# EAGLE schematic Bottom_PCB (EAGLE 9.7.0)
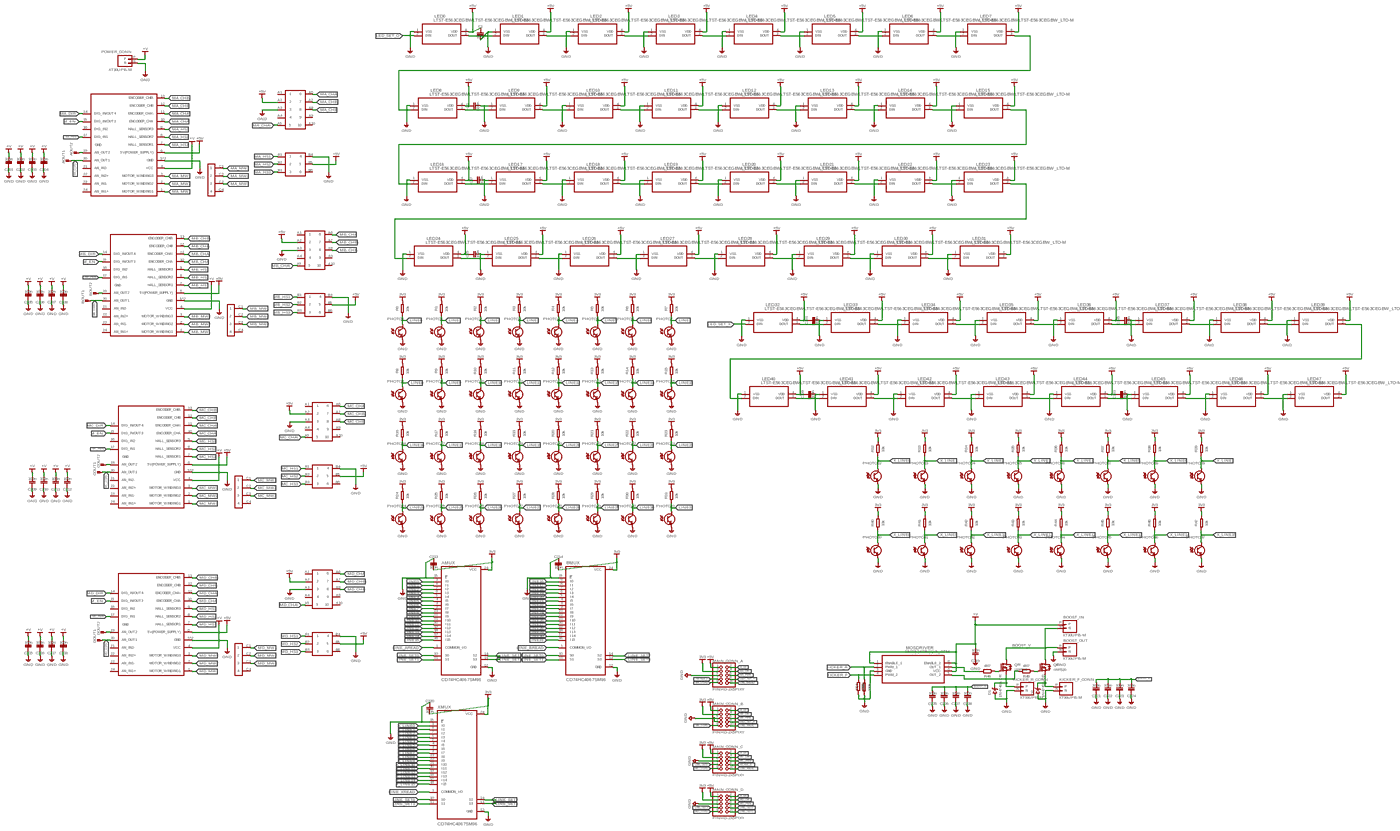
[diagram p0: schematic, sheet 1, overview]
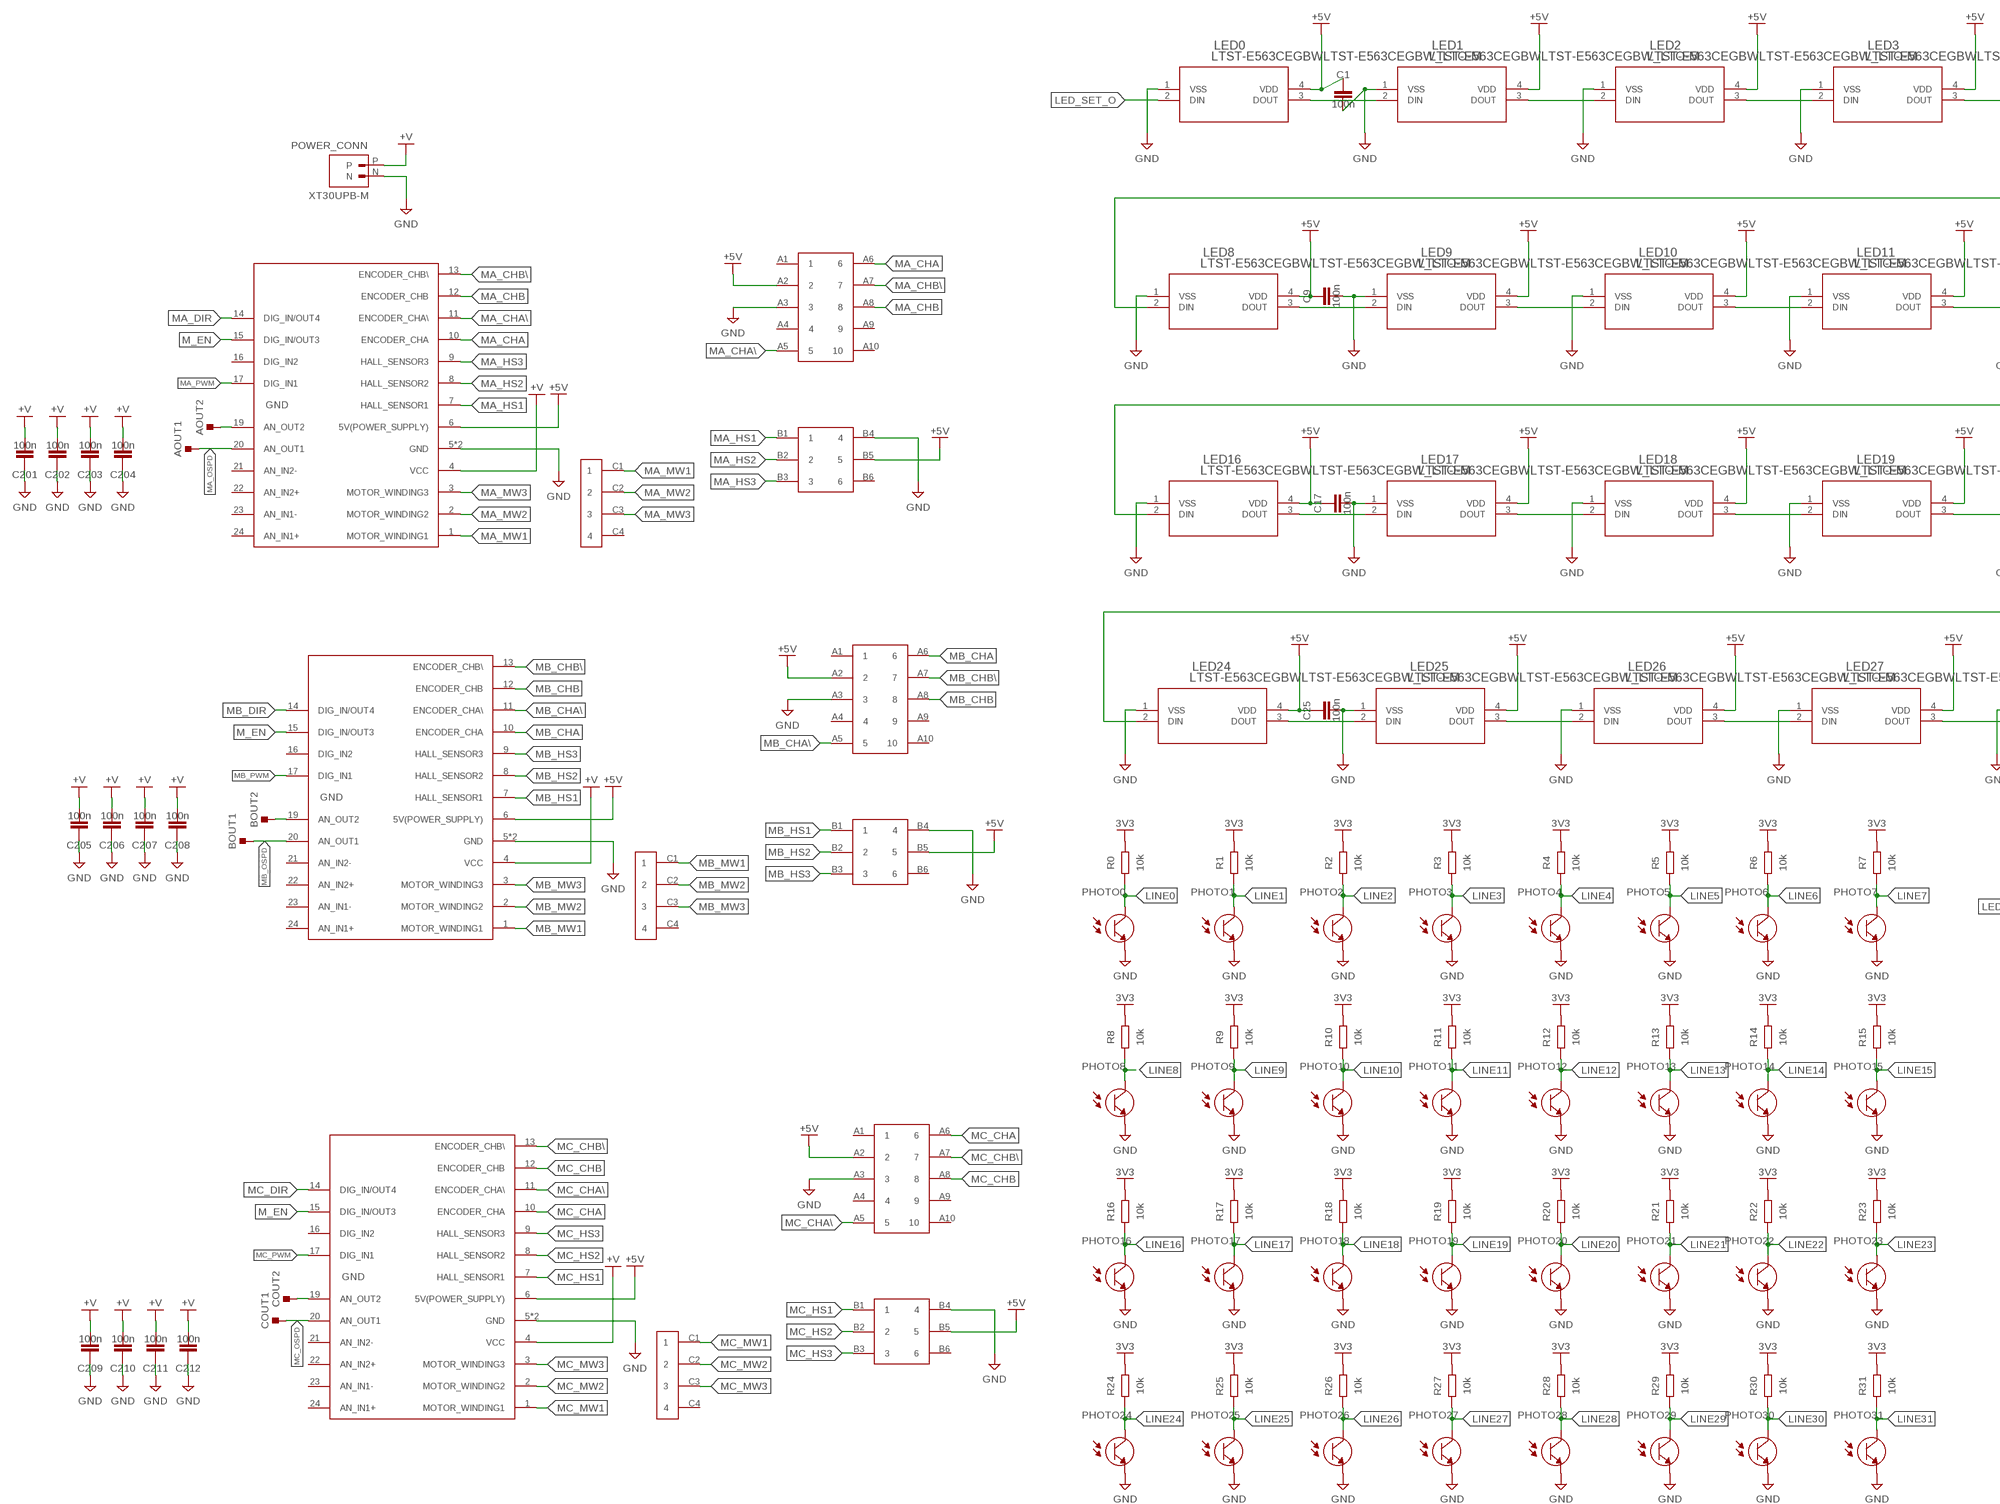
[diagram p1: schematic, sheet 1, part 1 of 4]
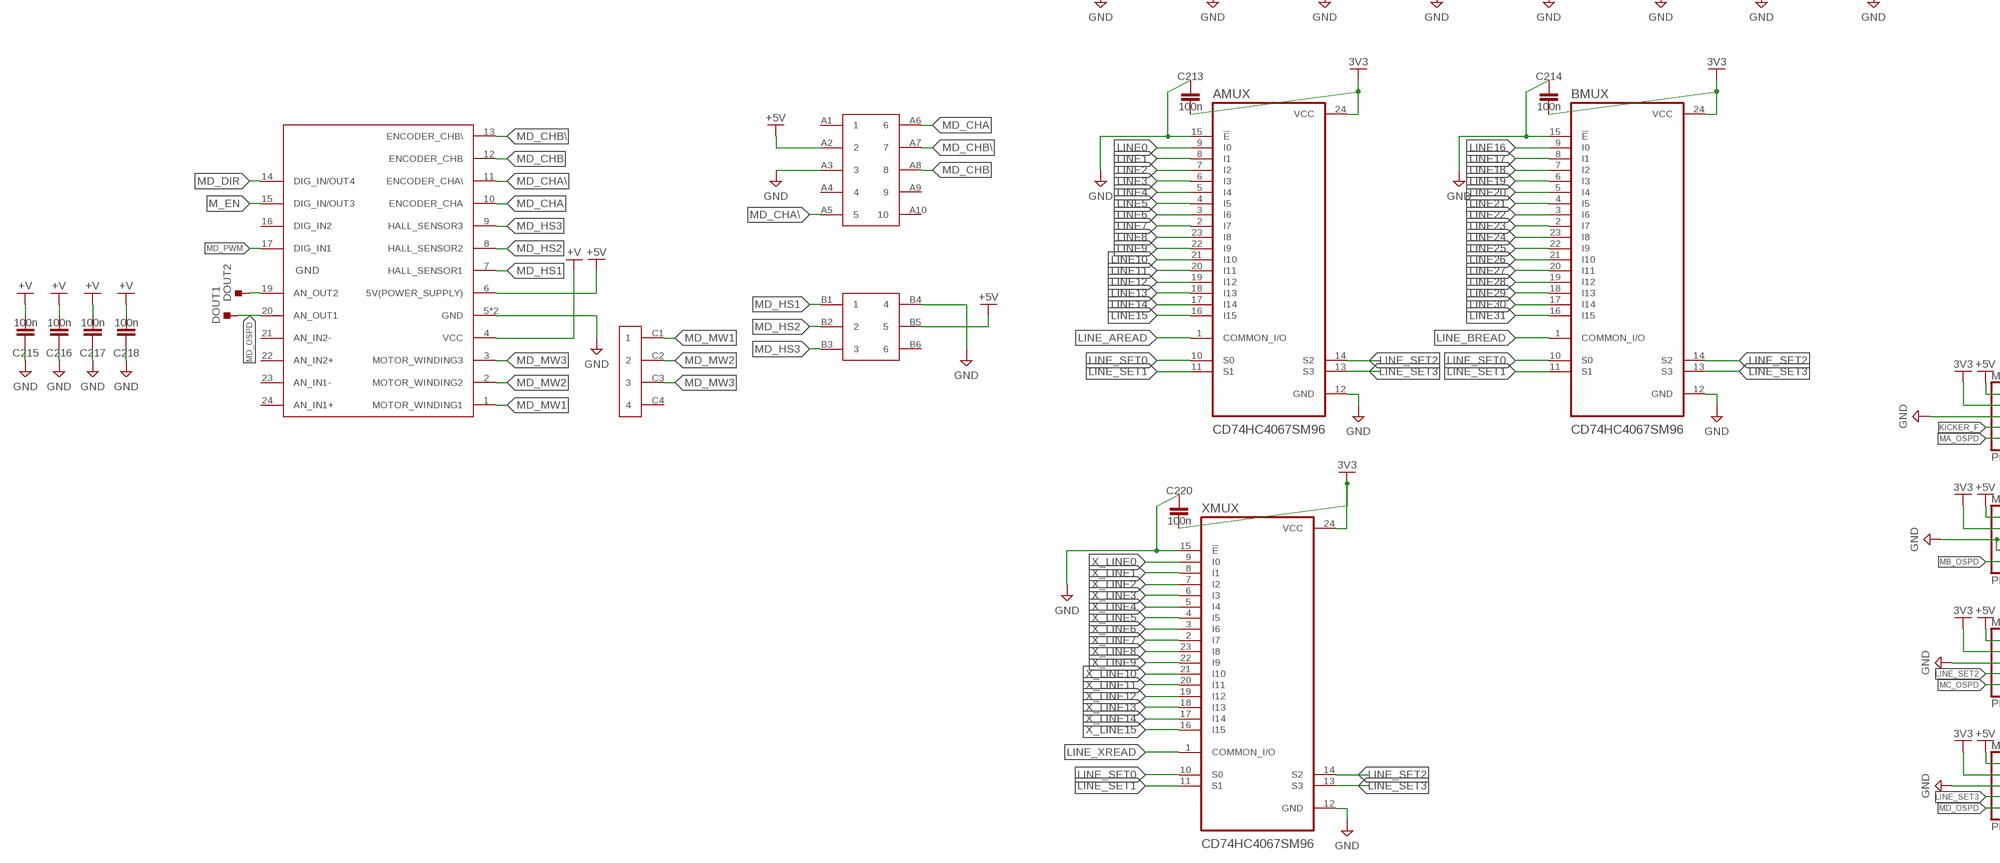
[diagram p2: schematic, sheet 1, part 2 of 4]
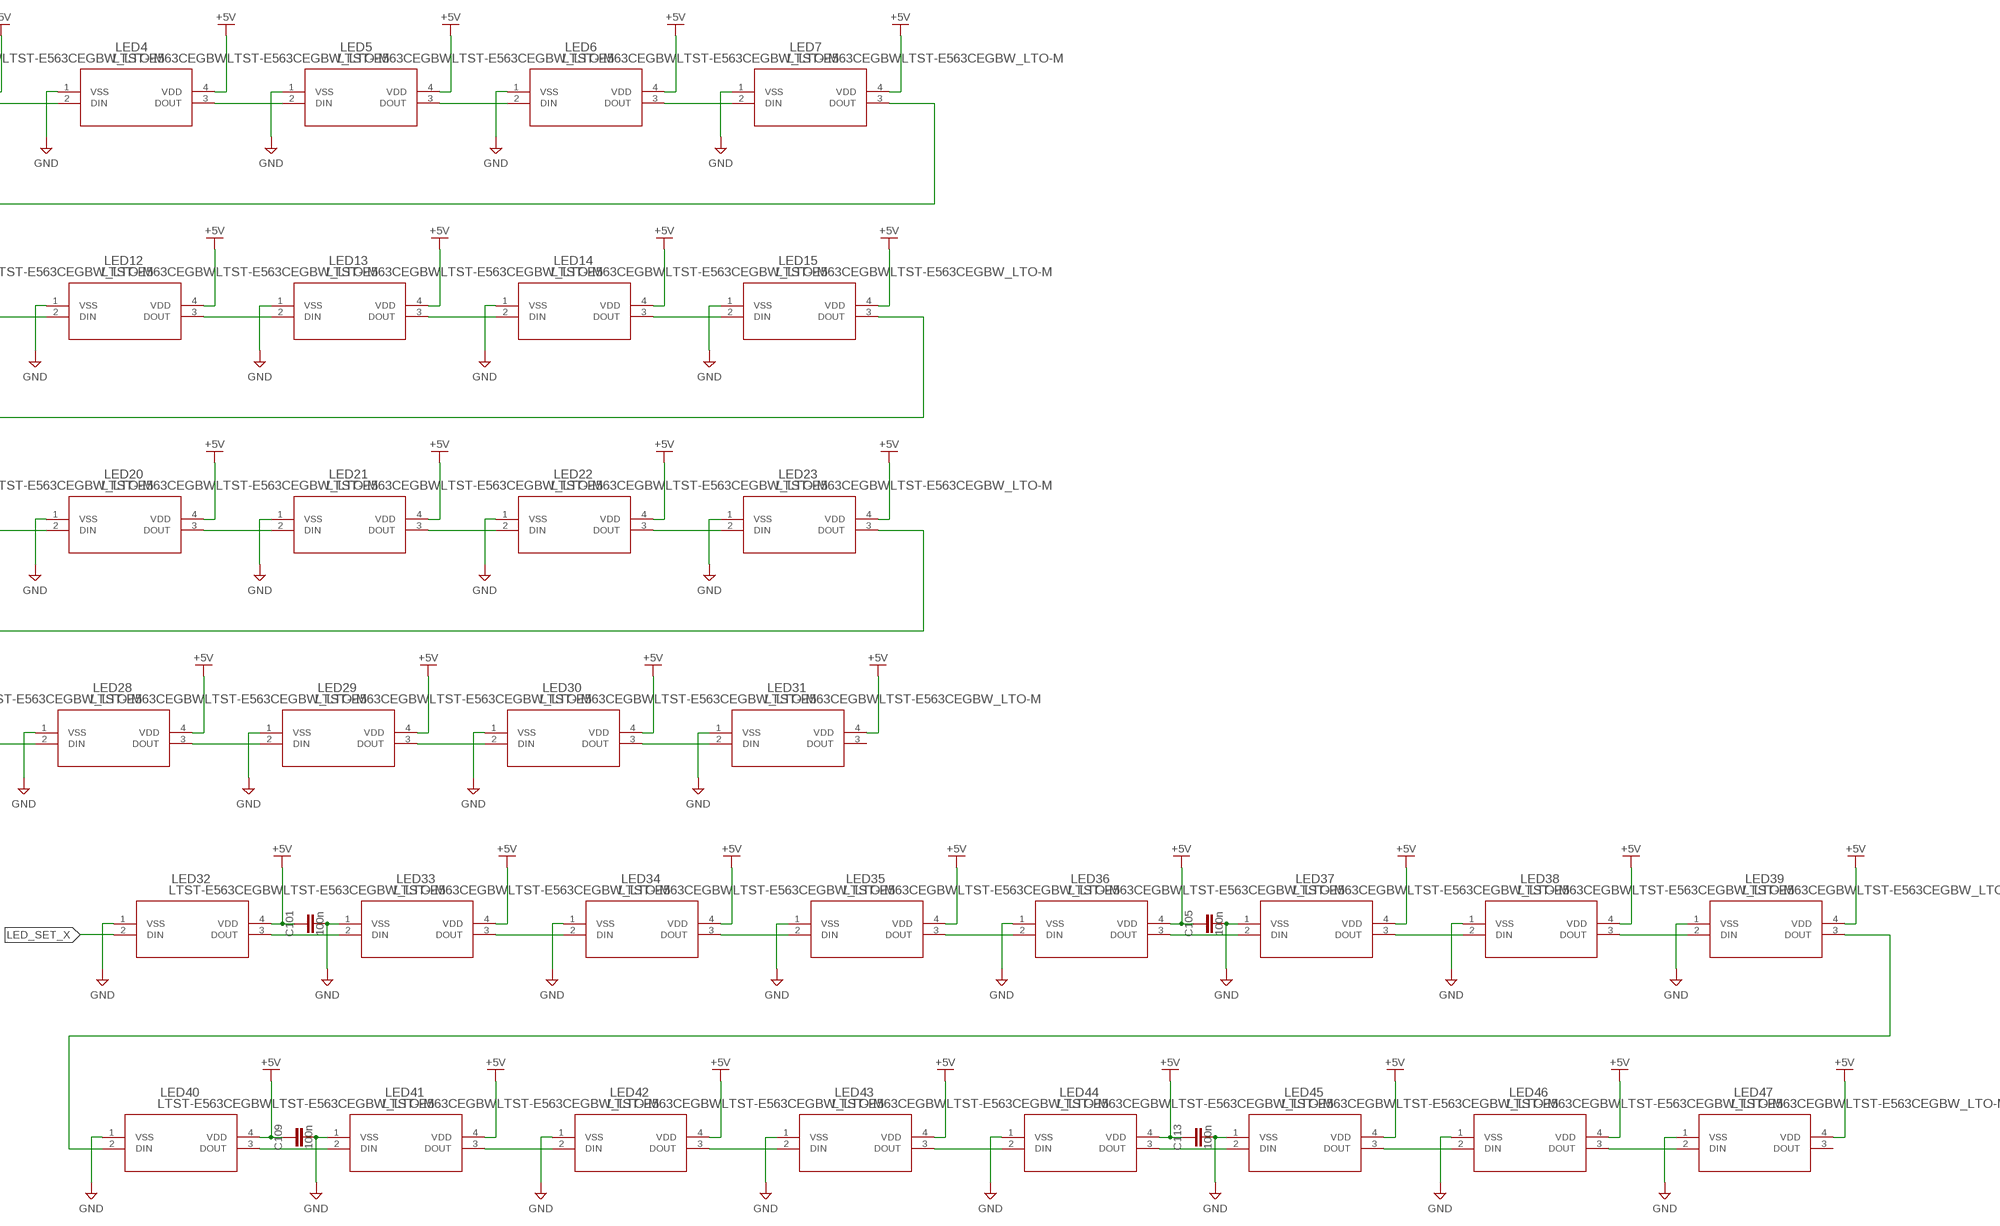
[diagram p3: schematic, sheet 1, part 3 of 4]
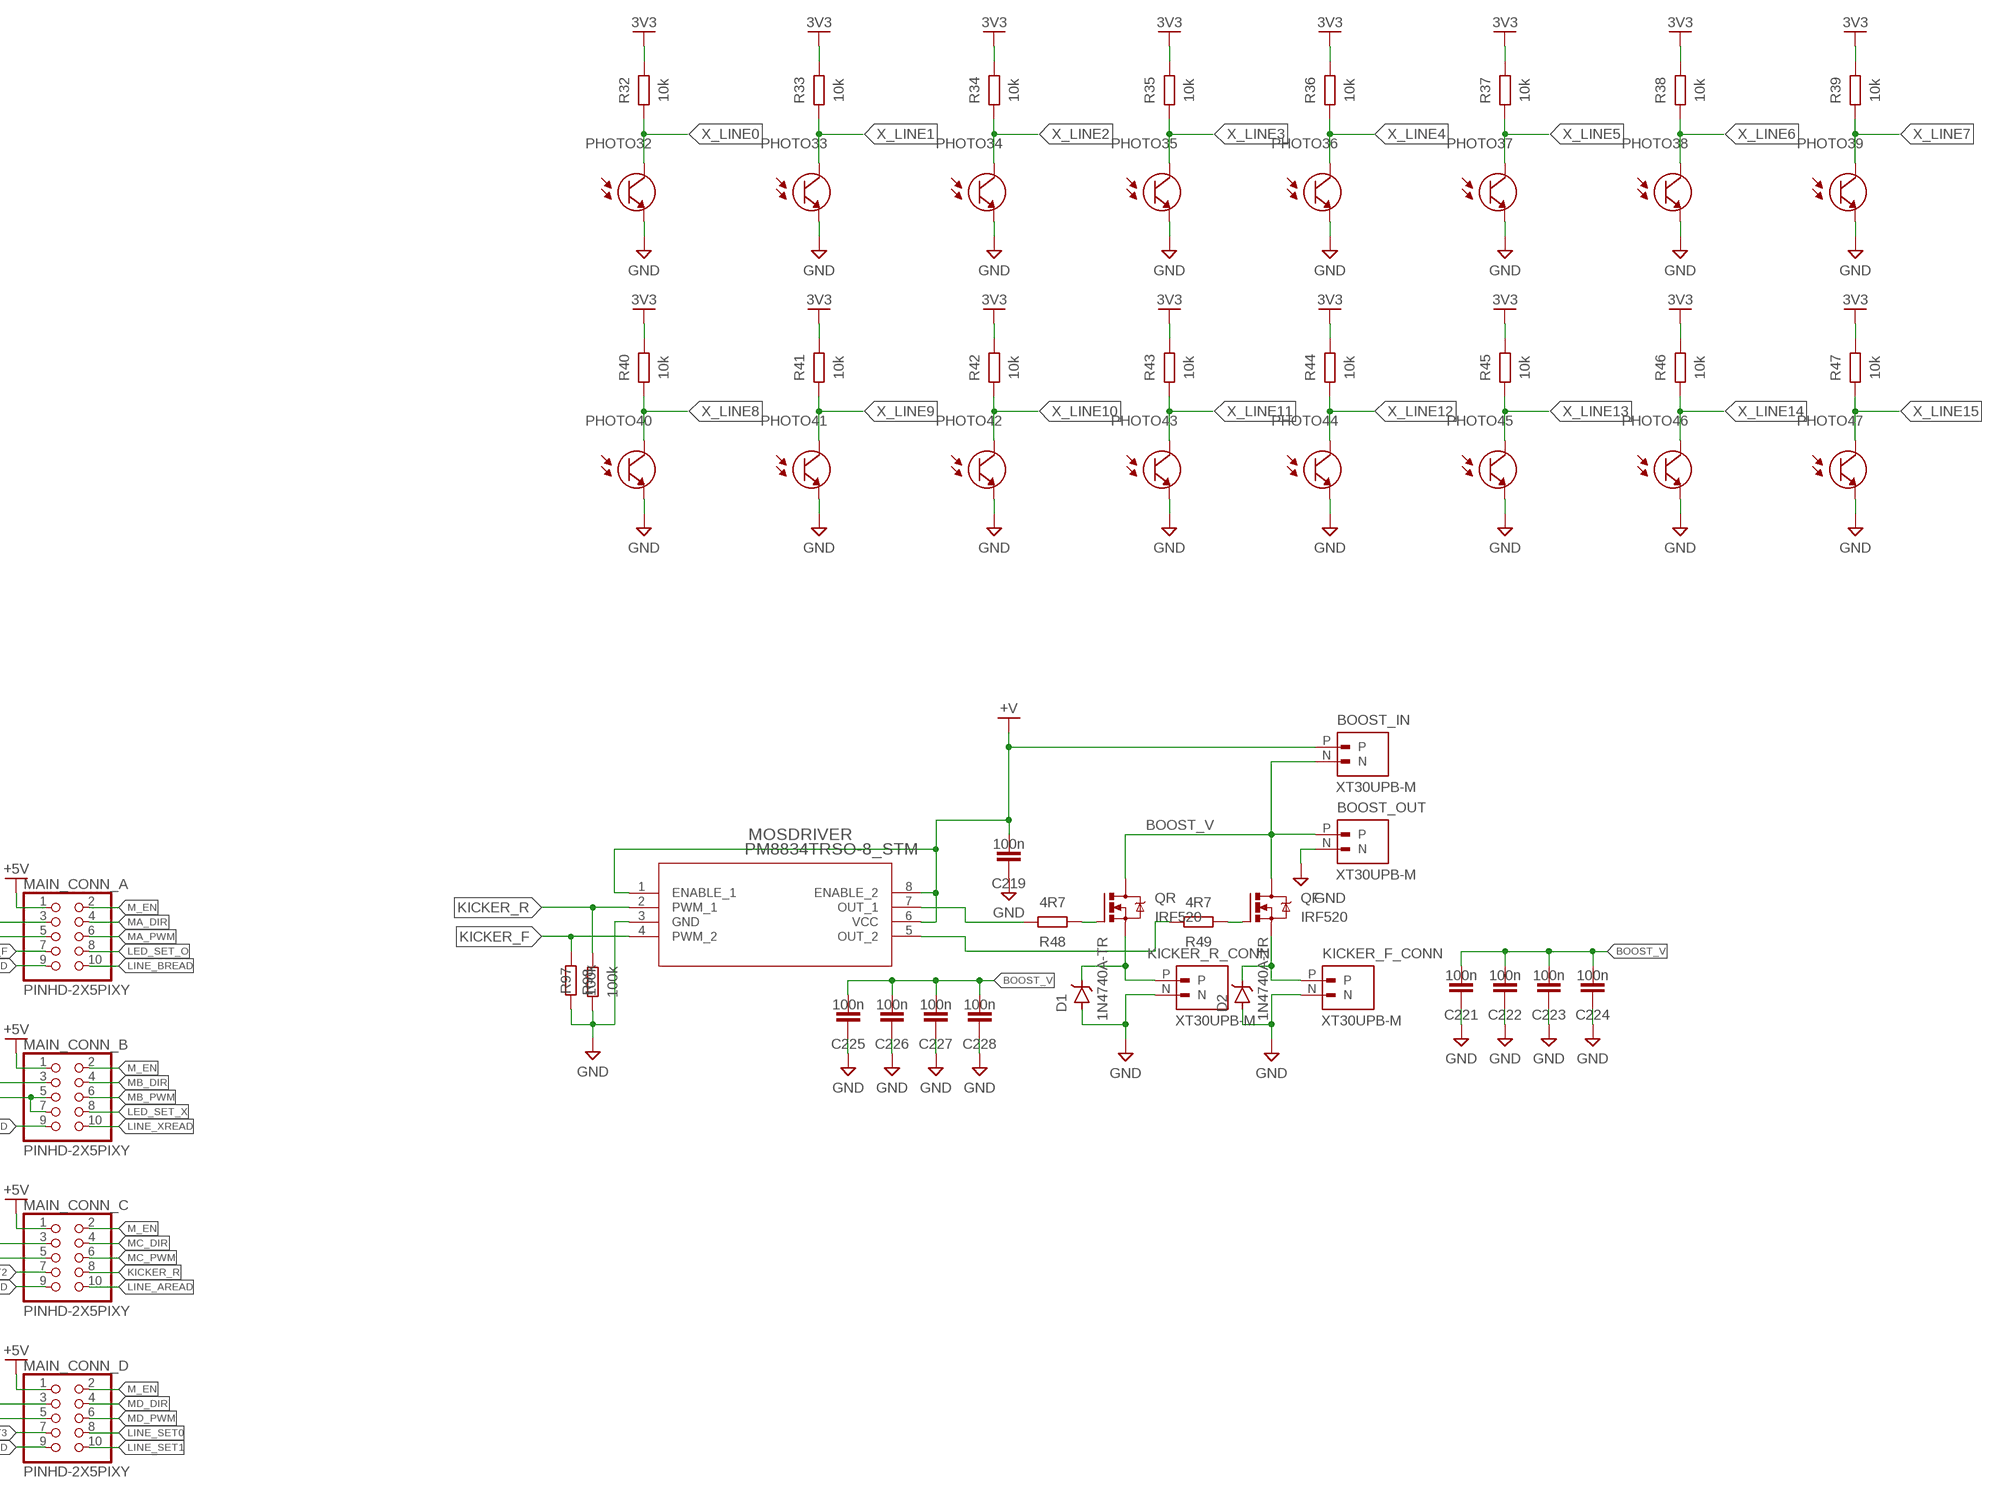
[diagram p4: schematic, sheet 1, part 4 of 4]

## Parts
AENC  PIN2.54-2X5  [PIN2.54-2X5]
AHAL  MX-44914-0601  [MX-44914-0601]
AMD  ESCON24/224/2  [ESCON24/2]
AMUX  CD74HC4067SM96  [SOP65P780X200-24N]
AMW  MX5566  [MX5566]
AOUT1  TESTPOINT_TPS-PAD-036  [TESTPOINT_PAD-036]
AOUT2  TESTPOINT_TPS-PAD-036  [TESTPOINT_PAD-036]
BENC  PIN2.54-2X5  [PIN2.54-2X5]
BHAL  MX-44914-0601  [MX-44914-0601]
BMD  ESCON24/224/2  [ESCON24/2]
BMUX  CD74HC4067SM96  [SOP65P780X200-24N]
BMW  MX5566  [MX5566]
BOOST_IN  XT30UPB-M  [AMASS_XT30UPB-M]
BOOST_OUT  XT30UPB-M  [AMASS_XT30UPB-M]
BOUT1  TESTPOINT_TPS-PAD-036  [TESTPOINT_PAD-036]
BOUT2  TESTPOINT_TPS-PAD-036  [TESTPOINT_PAD-036]
C1  100n  C_CHIP-0805(2012-METRIC)  [CAPC2012X110]
C9  100n  C_CHIP-0805(2012-METRIC)  [CAPC2012X110]
C17  100n  C_CHIP-0805(2012-METRIC)  [CAPC2012X110]
C25  100n  C_CHIP-0805(2012-METRIC)  [CAPC2012X110]
C101  100n  C_CHIP-0805(2012-METRIC)  [CAPC2012X110]
C105  100n  C_CHIP-0805(2012-METRIC)  [CAPC2012X110]
C109  100n  C_CHIP-0805(2012-METRIC)  [CAPC2012X110]
C113  100n  C_CHIP-0805(2012-METRIC)  [CAPC2012X110]
C201  100n  C_CHIP-0805(2012-METRIC)  [CAPC2012X110]
C202  100n  C_CHIP-0805(2012-METRIC)  [CAPC2012X110]
C203  100n  C_CHIP-0805(2012-METRIC)  [CAPC2012X110]
C204  100n  C_CHIP-0805(2012-METRIC)  [CAPC2012X110]
C205  100n  C_CHIP-0805(2012-METRIC)  [CAPC2012X110]
C206  100n  C_CHIP-0805(2012-METRIC)  [CAPC2012X110]
C207  100n  C_CHIP-0805(2012-METRIC)  [CAPC2012X110]
C208  100n  C_CHIP-0805(2012-METRIC)  [CAPC2012X110]
C209  100n  C_CHIP-0805(2012-METRIC)  [CAPC2012X110]
C210  100n  C_CHIP-0805(2012-METRIC)  [CAPC2012X110]
C211  100n  C_CHIP-0805(2012-METRIC)  [CAPC2012X110]
C212  100n  C_CHIP-0805(2012-METRIC)  [CAPC2012X110]
C213  100n  C_CHIP-0805(2012-METRIC)  [CAPC2012X110]
C214  100n  C_CHIP-0805(2012-METRIC)  [CAPC2012X110]
C215  100n  C_CHIP-0805(2012-METRIC)  [CAPC2012X110]
C216  100n  C_CHIP-0805(2012-METRIC)  [CAPC2012X110]
C217  100n  C_CHIP-0805(2012-METRIC)  [CAPC2012X110]
C218  100n  C_CHIP-0805(2012-METRIC)  [CAPC2012X110]
C219  100n  C_CHIP-0805(2012-METRIC)  [CAPC2012X110]
C220  100n  C_CHIP-0805(2012-METRIC)  [CAPC2012X110]
C221  100n  C_CHIP-0805(2012-METRIC)  [CAPC2012X110]
C222  100n  C_CHIP-0805(2012-METRIC)  [CAPC2012X110]
C223  100n  C_CHIP-0805(2012-METRIC)  [CAPC2012X110]
C224  100n  C_CHIP-0805(2012-METRIC)  [CAPC2012X110]
C225  100n  C_CHIP-0805(2012-METRIC)  [CAPC2012X110]
C226  100n  C_CHIP-0805(2012-METRIC)  [CAPC2012X110]
C227  100n  C_CHIP-0805(2012-METRIC)  [CAPC2012X110]
C228  100n  C_CHIP-0805(2012-METRIC)  [CAPC2012X110]
CENC  PIN2.54-2X5  [PIN2.54-2X5]
CHAL  MX-44914-0601  [MX-44914-0601]
CMD  ESCON24/224/2  [ESCON24/2]
CMW  MX5566  [MX5566]
COUT1  TESTPOINT_TPS-PAD-036  [TESTPOINT_PAD-036]
COUT2  TESTPOINT_TPS-PAD-036  [TESTPOINT_PAD-036]
D1  1N4740A-TR  [DO-41]
D2  1N4740A-TR  [DO-41]
DENC  PIN2.54-2X5  [PIN2.54-2X5]
DHAL  MX-44914-0601  [MX-44914-0601]
DMD  ESCON24/224/2  [ESCON24/2]
DMW  MX5566  [MX5566]
DOUT1  TESTPOINT_TPS-PAD-036  [TESTPOINT_PAD-036]
DOUT2  TESTPOINT_TPS-PAD-036  [TESTPOINT_PAD-036]
KICKER_F_CONN  XT30UPB-M  [AMASS_XT30UPB-M]
KICKER_R_CONN  XT30UPB-M  [AMASS_XT30UPB-M]
LED0  LTST-E563CEGBWLTST-E563CEGBW_LTO-M  [LTST-E563CEGBW_LTO-M]
LED1  LTST-E563CEGBWLTST-E563CEGBW_LTO-M  [LTST-E563CEGBW_LTO-M]
LED2  LTST-E563CEGBWLTST-E563CEGBW_LTO-M  [LTST-E563CEGBW_LTO-M]
LED3  LTST-E563CEGBWLTST-E563CEGBW_LTO-M  [LTST-E563CEGBW_LTO-M]
LED4  LTST-E563CEGBWLTST-E563CEGBW_LTO-M  [LTST-E563CEGBW_LTO-M]
LED5  LTST-E563CEGBWLTST-E563CEGBW_LTO-M  [LTST-E563CEGBW_LTO-M]
LED6  LTST-E563CEGBWLTST-E563CEGBW_LTO-M  [LTST-E563CEGBW_LTO-M]
LED7  LTST-E563CEGBWLTST-E563CEGBW_LTO-M  [LTST-E563CEGBW_LTO-M]
LED8  LTST-E563CEGBWLTST-E563CEGBW_LTO-M  [LTST-E563CEGBW_LTO-M]
LED9  LTST-E563CEGBWLTST-E563CEGBW_LTO-M  [LTST-E563CEGBW_LTO-M]
LED10  LTST-E563CEGBWLTST-E563CEGBW_LTO-M  [LTST-E563CEGBW_LTO-M]
LED11  LTST-E563CEGBWLTST-E563CEGBW_LTO-M  [LTST-E563CEGBW_LTO-M]
LED12  LTST-E563CEGBWLTST-E563CEGBW_LTO-M  [LTST-E563CEGBW_LTO-M]
LED13  LTST-E563CEGBWLTST-E563CEGBW_LTO-M  [LTST-E563CEGBW_LTO-M]
LED14  LTST-E563CEGBWLTST-E563CEGBW_LTO-M  [LTST-E563CEGBW_LTO-M]
LED15  LTST-E563CEGBWLTST-E563CEGBW_LTO-M  [LTST-E563CEGBW_LTO-M]
LED16  LTST-E563CEGBWLTST-E563CEGBW_LTO-M  [LTST-E563CEGBW_LTO-M]
LED17  LTST-E563CEGBWLTST-E563CEGBW_LTO-M  [LTST-E563CEGBW_LTO-M]
LED18  LTST-E563CEGBWLTST-E563CEGBW_LTO-M  [LTST-E563CEGBW_LTO-M]
LED19  LTST-E563CEGBWLTST-E563CEGBW_LTO-M  [LTST-E563CEGBW_LTO-M]
LED20  LTST-E563CEGBWLTST-E563CEGBW_LTO-M  [LTST-E563CEGBW_LTO-M]
LED21  LTST-E563CEGBWLTST-E563CEGBW_LTO-M  [LTST-E563CEGBW_LTO-M]
LED22  LTST-E563CEGBWLTST-E563CEGBW_LTO-M  [LTST-E563CEGBW_LTO-M]
LED23  LTST-E563CEGBWLTST-E563CEGBW_LTO-M  [LTST-E563CEGBW_LTO-M]
LED24  LTST-E563CEGBWLTST-E563CEGBW_LTO-M  [LTST-E563CEGBW_LTO-M]
LED25  LTST-E563CEGBWLTST-E563CEGBW_LTO-M  [LTST-E563CEGBW_LTO-M]
LED26  LTST-E563CEGBWLTST-E563CEGBW_LTO-M  [LTST-E563CEGBW_LTO-M]
LED27  LTST-E563CEGBWLTST-E563CEGBW_LTO-M  [LTST-E563CEGBW_LTO-M]
LED28  LTST-E563CEGBWLTST-E563CEGBW_LTO-M  [LTST-E563CEGBW_LTO-M]
LED29  LTST-E563CEGBWLTST-E563CEGBW_LTO-M  [LTST-E563CEGBW_LTO-M]
LED30  LTST-E563CEGBWLTST-E563CEGBW_LTO-M  [LTST-E563CEGBW_LTO-M]
LED31  LTST-E563CEGBWLTST-E563CEGBW_LTO-M  [LTST-E563CEGBW_LTO-M]
LED32  LTST-E563CEGBWLTST-E563CEGBW_LTO-M  [LTST-E563CEGBW_LTO-M]
LED33  LTST-E563CEGBWLTST-E563CEGBW_LTO-M  [LTST-E563CEGBW_LTO-M]
LED34  LTST-E563CEGBWLTST-E563CEGBW_LTO-M  [LTST-E563CEGBW_LTO-M]
LED35  LTST-E563CEGBWLTST-E563CEGBW_LTO-M  [LTST-E563CEGBW_LTO-M]
LED36  LTST-E563CEGBWLTST-E563CEGBW_LTO-M  [LTST-E563CEGBW_LTO-M]
LED37  LTST-E563CEGBWLTST-E563CEGBW_LTO-M  [LTST-E563CEGBW_LTO-M]
LED38  LTST-E563CEGBWLTST-E563CEGBW_LTO-M  [LTST-E563CEGBW_LTO-M]
LED39  LTST-E563CEGBWLTST-E563CEGBW_LTO-M  [LTST-E563CEGBW_LTO-M]
LED40  LTST-E563CEGBWLTST-E563CEGBW_LTO-M  [LTST-E563CEGBW_LTO-M]
LED41  LTST-E563CEGBWLTST-E563CEGBW_LTO-M  [LTST-E563CEGBW_LTO-M]
LED42  LTST-E563CEGBWLTST-E563CEGBW_LTO-M  [LTST-E563CEGBW_LTO-M]
LED43  LTST-E563CEGBWLTST-E563CEGBW_LTO-M  [LTST-E563CEGBW_LTO-M]
LED44  LTST-E563CEGBWLTST-E563CEGBW_LTO-M  [LTST-E563CEGBW_LTO-M]
LED45  LTST-E563CEGBWLTST-E563CEGBW_LTO-M  [LTST-E563CEGBW_LTO-M]
LED46  LTST-E563CEGBWLTST-E563CEGBW_LTO-M  [LTST-E563CEGBW_LTO-M]
LED47  LTST-E563CEGBWLTST-E563CEGBW_LTO-M  [LTST-E563CEGBW_LTO-M]
MAIN_CONN_A  PINHD-2X5PIXY  [2X05]
MAIN_CONN_B  PINHD-2X5PIXY  [2X05]
MAIN_CONN_C  PINHD-2X5PIXY  [2X05]
MAIN_CONN_D  PINHD-2X5PIXY  [2X05]
MOSDRIVER  PM8834TRSO-8_STM  [SO-8_STM]
PHOTO0  RPM-075PTT86TRANS_RPM-075P_ROM  [TRANS_RPM-075P_ROM]
PHOTO1  RPM-075PTT86TRANS_RPM-075P_ROM  [TRANS_RPM-075P_ROM]
PHOTO2  RPM-075PTT86TRANS_RPM-075P_ROM  [TRANS_RPM-075P_ROM]
PHOTO3  RPM-075PTT86TRANS_RPM-075P_ROM  [TRANS_RPM-075P_ROM]
PHOTO4  RPM-075PTT86TRANS_RPM-075P_ROM  [TRANS_RPM-075P_ROM]
PHOTO5  RPM-075PTT86TRANS_RPM-075P_ROM  [TRANS_RPM-075P_ROM]
PHOTO6  RPM-075PTT86TRANS_RPM-075P_ROM  [TRANS_RPM-075P_ROM]
PHOTO7  RPM-075PTT86TRANS_RPM-075P_ROM  [TRANS_RPM-075P_ROM]
PHOTO8  RPM-075PTT86TRANS_RPM-075P_ROM  [TRANS_RPM-075P_ROM]
PHOTO9  RPM-075PTT86TRANS_RPM-075P_ROM  [TRANS_RPM-075P_ROM]
PHOTO10  RPM-075PTT86TRANS_RPM-075P_ROM  [TRANS_RPM-075P_ROM]
PHOTO11  RPM-075PTT86TRANS_RPM-075P_ROM  [TRANS_RPM-075P_ROM]
PHOTO12  RPM-075PTT86TRANS_RPM-075P_ROM  [TRANS_RPM-075P_ROM]
PHOTO13  RPM-075PTT86TRANS_RPM-075P_ROM  [TRANS_RPM-075P_ROM]
PHOTO14  RPM-075PTT86TRANS_RPM-075P_ROM  [TRANS_RPM-075P_ROM]
PHOTO15  RPM-075PTT86TRANS_RPM-075P_ROM  [TRANS_RPM-075P_ROM]
PHOTO16  RPM-075PTT86TRANS_RPM-075P_ROM  [TRANS_RPM-075P_ROM]
PHOTO17  RPM-075PTT86TRANS_RPM-075P_ROM  [TRANS_RPM-075P_ROM]
PHOTO18  RPM-075PTT86TRANS_RPM-075P_ROM  [TRANS_RPM-075P_ROM]
PHOTO19  RPM-075PTT86TRANS_RPM-075P_ROM  [TRANS_RPM-075P_ROM]
PHOTO20  RPM-075PTT86TRANS_RPM-075P_ROM  [TRANS_RPM-075P_ROM]
PHOTO21  RPM-075PTT86TRANS_RPM-075P_ROM  [TRANS_RPM-075P_ROM]
PHOTO22  RPM-075PTT86TRANS_RPM-075P_ROM  [TRANS_RPM-075P_ROM]
PHOTO23  RPM-075PTT86TRANS_RPM-075P_ROM  [TRANS_RPM-075P_ROM]
PHOTO24  RPM-075PTT86TRANS_RPM-075P_ROM  [TRANS_RPM-075P_ROM]
PHOTO25  RPM-075PTT86TRANS_RPM-075P_ROM  [TRANS_RPM-075P_ROM]
PHOTO26  RPM-075PTT86TRANS_RPM-075P_ROM  [TRANS_RPM-075P_ROM]
PHOTO27  RPM-075PTT86TRANS_RPM-075P_ROM  [TRANS_RPM-075P_ROM]
PHOTO28  RPM-075PTT86TRANS_RPM-075P_ROM  [TRANS_RPM-075P_ROM]
PHOTO29  RPM-075PTT86TRANS_RPM-075P_ROM  [TRANS_RPM-075P_ROM]
PHOTO30  RPM-075PTT86TRANS_RPM-075P_ROM  [TRANS_RPM-075P_ROM]
PHOTO31  RPM-075PTT86TRANS_RPM-075P_ROM  [TRANS_RPM-075P_ROM]
PHOTO32  RPM-075PTT86TRANS_RPM-075P_ROM  [TRANS_RPM-075P_ROM]
PHOTO33  RPM-075PTT86TRANS_RPM-075P_ROM  [TRANS_RPM-075P_ROM]
PHOTO34  RPM-075PTT86TRANS_RPM-075P_ROM  [TRANS_RPM-075P_ROM]
PHOTO35  RPM-075PTT86TRANS_RPM-075P_ROM  [TRANS_RPM-075P_ROM]
PHOTO36  RPM-075PTT86TRANS_RPM-075P_ROM  [TRANS_RPM-075P_ROM]
PHOTO37  RPM-075PTT86TRANS_RPM-075P_ROM  [TRANS_RPM-075P_ROM]
PHOTO38  RPM-075PTT86TRANS_RPM-075P_ROM  [TRANS_RPM-075P_ROM]
PHOTO39  RPM-075PTT86TRANS_RPM-075P_ROM  [TRANS_RPM-075P_ROM]
PHOTO40  RPM-075PTT86TRANS_RPM-075P_ROM  [TRANS_RPM-075P_ROM]
PHOTO41  RPM-075PTT86TRANS_RPM-075P_ROM  [TRANS_RPM-075P_ROM]
PHOTO42  RPM-075PTT86TRANS_RPM-075P_ROM  [TRANS_RPM-075P_ROM]
PHOTO43  RPM-075PTT86TRANS_RPM-075P_ROM  [TRANS_RPM-075P_ROM]
PHOTO44  RPM-075PTT86TRANS_RPM-075P_ROM  [TRANS_RPM-075P_ROM]
PHOTO45  RPM-075PTT86TRANS_RPM-075P_ROM  [TRANS_RPM-075P_ROM]
PHOTO46  RPM-075PTT86TRANS_RPM-075P_ROM  [TRANS_RPM-075P_ROM]
PHOTO47  RPM-075PTT86TRANS_RPM-075P_ROM  [TRANS_RPM-075P_ROM]
POWER_CONN  XT30UPB-M  [AMASS_XT30UPB-M]
QF  IRF520  NMOSFET_IRF520_TO220  [TO220BV]
QR  IRF520  NMOSFET_IRF520_TO220  [TO220BV]
R0  10k  R_CHIP-0805(2012-METRIC)  [RESC2012X65]
R1  10k  R_CHIP-0805(2012-METRIC)  [RESC2012X65]
R2  10k  R_CHIP-0805(2012-METRIC)  [RESC2012X65]
R3  10k  R_CHIP-0805(2012-METRIC)  [RESC2012X65]
R4  10k  R_CHIP-0805(2012-METRIC)  [RESC2012X65]
R5  10k  R_CHIP-0805(2012-METRIC)  [RESC2012X65]
R6  10k  R_CHIP-0805(2012-METRIC)  [RESC2012X65]
R7  10k  R_CHIP-0805(2012-METRIC)  [RESC2012X65]
R8  10k  R_CHIP-0805(2012-METRIC)  [RESC2012X65]
R9  10k  R_CHIP-0805(2012-METRIC)  [RESC2012X65]
R10  10k  R_CHIP-0805(2012-METRIC)  [RESC2012X65]
R11  10k  R_CHIP-0805(2012-METRIC)  [RESC2012X65]
R12  10k  R_CHIP-0805(2012-METRIC)  [RESC2012X65]
R13  10k  R_CHIP-0805(2012-METRIC)  [RESC2012X65]
R14  10k  R_CHIP-0805(2012-METRIC)  [RESC2012X65]
R15  10k  R_CHIP-0805(2012-METRIC)  [RESC2012X65]
R16  10k  R_CHIP-0805(2012-METRIC)  [RESC2012X65]
R17  10k  R_CHIP-0805(2012-METRIC)  [RESC2012X65]
R18  10k  R_CHIP-0805(2012-METRIC)  [RESC2012X65]
R19  10k  R_CHIP-0805(2012-METRIC)  [RESC2012X65]
R20  10k  R_CHIP-0805(2012-METRIC)  [RESC2012X65]
R21  10k  R_CHIP-0805(2012-METRIC)  [RESC2012X65]
R22  10k  R_CHIP-0805(2012-METRIC)  [RESC2012X65]
R23  10k  R_CHIP-0805(2012-METRIC)  [RESC2012X65]
R24  10k  R_CHIP-0805(2012-METRIC)  [RESC2012X65]
R25  10k  R_CHIP-0805(2012-METRIC)  [RESC2012X65]
R26  10k  R_CHIP-0805(2012-METRIC)  [RESC2012X65]
R27  10k  R_CHIP-0805(2012-METRIC)  [RESC2012X65]
R28  10k  R_CHIP-0805(2012-METRIC)  [RESC2012X65]
R29  10k  R_CHIP-0805(2012-METRIC)  [RESC2012X65]
R30  10k  R_CHIP-0805(2012-METRIC)  [RESC2012X65]
R31  10k  R_CHIP-0805(2012-METRIC)  [RESC2012X65]
R32  10k  R_CHIP-0805(2012-METRIC)  [RESC2012X65]
R33  10k  R_CHIP-0805(2012-METRIC)  [RESC2012X65]
R34  10k  R_CHIP-0805(2012-METRIC)  [RESC2012X65]
R35  10k  R_CHIP-0805(2012-METRIC)  [RESC2012X65]
R36  10k  R_CHIP-0805(2012-METRIC)  [RESC2012X65]
R37  10k  R_CHIP-0805(2012-METRIC)  [RESC2012X65]
R38  10k  R_CHIP-0805(2012-METRIC)  [RESC2012X65]
R39  10k  R_CHIP-0805(2012-METRIC)  [RESC2012X65]
R40  10k  R_CHIP-0805(2012-METRIC)  [RESC2012X65]
R41  10k  R_CHIP-0805(2012-METRIC)  [RESC2012X65]
R42  10k  R_CHIP-0805(2012-METRIC)  [RESC2012X65]
R43  10k  R_CHIP-0805(2012-METRIC)  [RESC2012X65]
R44  10k  R_CHIP-0805(2012-METRIC)  [RESC2012X65]
R45  10k  R_CHIP-0805(2012-METRIC)  [RESC2012X65]
R46  10k  R_CHIP-0805(2012-METRIC)  [RESC2012X65]
R47  10k  R_CHIP-0805(2012-METRIC)  [RESC2012X65]
R48  4R7  R_CHIP-0805(2012-METRIC)  [RESC2012X65]
R49  4R7  R_CHIP-0805(2012-METRIC)  [RESC2012X65]
R97  100k  R_CHIP-0805(2012-METRIC)  [RESC2012X65]
R98  100k  R_CHIP-0805(2012-METRIC)  [RESC2012X65]
XMUX  CD74HC4067SM96  [SOP65P780X200-24N]

## Nets
3V3: AMUX.24(VCC) BMUX.24(VCC) C213.2 C214.2 C220.2 MAIN_CONN_A.3 MAIN_CONN_B.3 MAIN_CONN_C.3 MAIN_CONN_D.3 R0.2 R1.2 R2.2 R3.2 R4.2 R5.2 R6.2 R7.2 R8.2 R9.2 R10.2 R11.2 R12.2 R13.2 R14.2 R15.2 R16.2 R17.2 R18.2 R19.2 R20.2 R21.2 R22.2 R23.2 R24.2 R25.2 R26.2 R27.2 R28.2 R29.2 R30.2 R31.2 R32.2 R33.2 R34.2 R35.2 R36.2 R37.2 R38.2 R39.2 R40.2 R41.2 R42.2 R43.2 R44.2 R45.2 R46.2 R47.2 XMUX.24(VCC)
+5V: AENC.A2 AHAL.B5 AMD.6(5V(POWER_SUPPLY)) BENC.A2 BHAL.B5 BMD.6(5V(POWER_SUPPLY)) C1.1 C9.1 C17.1 C25.1 C101.1 C105.1 C109.1 C113.1 CENC.A2 CHAL.B5 CMD.6(5V(POWER_SUPPLY)) DENC.A2 DHAL.B5 DMD.6(5V(POWER_SUPPLY)) LED0.4(VDD) LED1.4(VDD) LED2.4(VDD) LED3.4(VDD) LED4.4(VDD) LED5.4(VDD) LED6.4(VDD) LED7.4(VDD) LED8.4(VDD) LED9.4(VDD) LED10.4(VDD) LED11.4(VDD) LED12.4(VDD) LED13.4(VDD) LED14.4(VDD) LED15.4(VDD) LED16.4(VDD) LED17.4(VDD) LED18.4(VDD) LED19.4(VDD) LED20.4(VDD) LED21.4(VDD) LED22.4(VDD) LED23.4(VDD) LED24.4(VDD) LED25.4(VDD) LED26.4(VDD) LED27.4(VDD) LED28.4(VDD) LED29.4(VDD) LED30.4(VDD) LED31.4(VDD) LED32.4(VDD) LED33.4(VDD) LED34.4(VDD) LED35.4(VDD) LED36.4(VDD) LED37.4(VDD) LED38.4(VDD) LED39.4(VDD) LED40.4(VDD) LED41.4(VDD) LED42.4(VDD) LED43.4(VDD) LED44.4(VDD) LED45.4(VDD) LED46.4(VDD) LED47.4(VDD) MAIN_CONN_A.1 MAIN_CONN_B.1 MAIN_CONN_C.1 MAIN_CONN_D.1
+V: AMD.4(VCC) BMD.4(VCC) BOOST_IN.P C201.2 C202.2 C203.2 C204.2 C205.2 C206.2 C207.2 C208.2 C209.2 C210.2 C211.2 C212.2 C215.2 C216.2 C217.2 C218.2 C219.2 CMD.4(VCC) DMD.4(VCC) MOSDRIVER.1(ENABLE_1) MOSDRIVER.6(VCC) MOSDRIVER.8(ENABLE_2) POWER_CONN.P
BOOST_V: BOOST_IN.N BOOST_OUT.P C221.2 C222.2 C223.2 C224.2 C225.2 C226.2 C227.2 C228.2 QF.D QR.D
GND: AENC.A3 AHAL.B4 AMD.5(GND) AMD.18(GND) AMUX.12(GND) AMUX.15(!E) BENC.A3 BHAL.B4 BMD.5(GND) BMD.18(GND) BMUX.12(GND) BMUX.15(!E) BOOST_OUT.N C1.2 C9.2 C17.2 C25.2 C101.2 C105.2 C109.2 C113.2 C201.1 C202.1 C203.1 C204.1 C205.1 C206.1 C207.1 C208.1 C209.1 C210.1 C211.1 C212.1 C213.1 C214.1 C215.1 C216.1 C217.1 C218.1 C219.1 C220.1 C221.1 C222.1 C223.1 C224.1 C225.1 C226.1 C227.1 C228.1 CENC.A3 CHAL.B4 CMD.5(GND) CMD.18(GND) D1.A D2.A DENC.A3 DHAL.B4 DMD.5(GND) DMD.18(GND) KICKER_F_CONN.N KICKER_R_CONN.N LED0.1(VSS) LED1.1(VSS) LED2.1(VSS) LED3.1(VSS) LED4.1(VSS) LED5.1(VSS) LED6.1(VSS) LED7.1(VSS) LED8.1(VSS) LED9.1(VSS) LED10.1(VSS) LED11.1(VSS) LED12.1(VSS) LED13.1(VSS) LED14.1(VSS) LED15.1(VSS) LED16.1(VSS) LED17.1(VSS) LED18.1(VSS) LED19.1(VSS) LED20.1(VSS) LED21.1(VSS) LED22.1(VSS) LED23.1(VSS) LED24.1(VSS) LED25.1(VSS) LED26.1(VSS) LED27.1(VSS) LED28.1(VSS) LED29.1(VSS) LED30.1(VSS) LED31.1(VSS) LED32.1(VSS) LED33.1(VSS) LED34.1(VSS) LED35.1(VSS) LED36.1(VSS) LED37.1(VSS) LED38.1(VSS) LED39.1(VSS) LED40.1(VSS) LED41.1(VSS) LED42.1(VSS) LED43.1(VSS) LED44.1(VSS) LED45.1(VSS) LED46.1(VSS) LED47.1(VSS) MAIN_CONN_A.5 MAIN_CONN_B.5 MAIN_CONN_B.7 MAIN_CONN_C.5 MAIN_CONN_D.5 MOSDRIVER.3(GND) PHOTO0.1 PHOTO1.1 PHOTO2.1 PHOTO3.1 PHOTO4.1 PHOTO5.1 PHOTO6.1 PHOTO7.1 PHOTO8.1 PHOTO9.1 PHOTO10.1 PHOTO11.1 PHOTO12.1 PHOTO13.1 PHOTO14.1 PHOTO15.1 PHOTO16.1 PHOTO17.1 PHOTO18.1 PHOTO19.1 PHOTO20.1 PHOTO21.1 PHOTO22.1 PHOTO23.1 PHOTO24.1 PHOTO25.1 PHOTO26.1 PHOTO27.1 PHOTO28.1 PHOTO29.1 PHOTO30.1 PHOTO31.1 PHOTO32.1 PHOTO33.1 PHOTO34.1 PHOTO35.1 PHOTO36.1 PHOTO37.1 PHOTO38.1 PHOTO39.1 PHOTO40.1 PHOTO41.1 PHOTO42.1 PHOTO43.1 PHOTO44.1 PHOTO45.1 PHOTO46.1 PHOTO47.1 POWER_CONN.N R97.1 R98.1 XMUX.12(GND) XMUX.15(!E)
KICKER_F: MAIN_CONN_A.7 MOSDRIVER.4(PWM_2) R97.2
KICKER_R: MAIN_CONN_C.8 MOSDRIVER.2(PWM_1) R98.2
LED_SET_O: LED0.2(DIN) MAIN_CONN_A.8
LED_SET_X: LED32.2(DIN) MAIN_CONN_B.8
LINE0: AMUX.9(I0) PHOTO0.2 R0.1
LINE1: AMUX.8(I1) PHOTO1.2 R1.1
LINE2: AMUX.7(I2) PHOTO2.2 R2.1
LINE3: AMUX.6(I3) PHOTO3.2 R3.1
LINE4: AMUX.5(I4) PHOTO4.2 R4.1
LINE5: AMUX.4(I5) PHOTO5.2 R5.1
LINE6: AMUX.3(I6) PHOTO6.2 R6.1
LINE7: AMUX.2(I7) PHOTO7.2 R7.1
LINE8: AMUX.23(I8) PHOTO8.2 R8.1
LINE9: AMUX.22(I9) PHOTO9.2 R9.1
LINE10: AMUX.21(I10) PHOTO10.2 R10.1
LINE11: AMUX.20(I11) PHOTO11.2 R11.1
LINE12: AMUX.19(I12) PHOTO12.2 R12.1
LINE13: AMUX.18(I13) PHOTO13.2 R13.1
LINE14: AMUX.17(I14) PHOTO14.2 R14.1
LINE15: AMUX.16(I15) PHOTO15.2 R15.1
LINE16: BMUX.9(I0) PHOTO16.2 R16.1
LINE17: BMUX.8(I1) PHOTO17.2 R17.1
LINE18: BMUX.7(I2) PHOTO18.2 R18.1
LINE19: BMUX.6(I3) PHOTO19.2 R19.1
LINE20: BMUX.5(I4) PHOTO20.2 R20.1
LINE21: BMUX.4(I5) PHOTO21.2 R21.1
LINE22: BMUX.3(I6) PHOTO22.2 R22.1
LINE23: BMUX.2(I7) PHOTO23.2 R23.1
LINE24: BMUX.23(I8) PHOTO24.2 R24.1
LINE25: BMUX.22(I9) PHOTO25.2 R25.1
LINE26: BMUX.21(I10) PHOTO26.2 R26.1
LINE27: BMUX.20(I11) PHOTO27.2 R27.1
LINE28: BMUX.19(I12) PHOTO28.2 R28.1
LINE29: BMUX.18(I13) PHOTO29.2 R29.1
LINE30: BMUX.17(I14) PHOTO30.2 R30.1
LINE31: BMUX.16(I15) PHOTO31.2 R31.1
LINE_AREAD: AMUX.1(COMMON_I/O) MAIN_CONN_C.10
LINE_BREAD: BMUX.1(COMMON_I/O) MAIN_CONN_A.10
LINE_SET0: AMUX.10(S0) BMUX.10(S0) MAIN_CONN_D.8 XMUX.10(S0)
LINE_SET1: AMUX.11(S1) BMUX.11(S1) MAIN_CONN_D.10 XMUX.11(S1)
LINE_SET2: AMUX.14(S2) BMUX.14(S2) MAIN_CONN_C.7 XMUX.14(S2)
LINE_SET3: AMUX.13(S3) BMUX.13(S3) MAIN_CONN_D.7 XMUX.13(S3)
LINE_XREAD: MAIN_CONN_B.10 XMUX.1(COMMON_I/O)
M_EN: AMD.15(DIG_IN/OUT3) BMD.15(DIG_IN/OUT3) CMD.15(DIG_IN/OUT3) DMD.15(DIG_IN/OUT3) MAIN_CONN_A.2 MAIN_CONN_B.2 MAIN_CONN_C.2 MAIN_CONN_D.2
MA_CHA: AENC.A6 AMD.10(ENCODER_CHA)
MA_CHA\\: AENC.A5 AMD.11(ENCODER_CHA\\)
MA_CHB: AENC.A8 AMD.12(ENCODER_CHB)
MA_CHB\\: AENC.A7 AMD.13(ENCODER_CHB\\)
MA_DIR: AMD.14(DIG_IN/OUT4) MAIN_CONN_A.4
MA_HS1: AHAL.B1 AMD.7(HALL_SENSOR1)
MA_HS2: AHAL.B2 AMD.8(HALL_SENSOR2)
MA_HS3: AHAL.B3 AMD.9(HALL_SENSOR3)
MA_MW1: AMD.1(MOTOR_WINDING1) AMW.C1
MA_MW2: AMD.2(MOTOR_WINDING2) AMW.C2
MA_MW3: AMD.3(MOTOR_WINDING3) AMW.C3
MA_OSPD: AMD.20(AN_OUT1) AOUT1.1(TP) MAIN_CONN_A.9
MA_PWM: AMD.17(DIG_IN1) MAIN_CONN_A.6
MB_CHA: BENC.A6 BMD.10(ENCODER_CHA)
MB_CHA\\: BENC.A5 BMD.11(ENCODER_CHA\\)
MB_CHB: BENC.A8 BMD.12(ENCODER_CHB)
MB_CHB\\: BENC.A7 BMD.13(ENCODER_CHB\\)
MB_DIR: BMD.14(DIG_IN/OUT4) MAIN_CONN_B.4
MB_HS1: BHAL.B1 BMD.7(HALL_SENSOR1)
MB_HS2: BHAL.B2 BMD.8(HALL_SENSOR2)
MB_HS3: BHAL.B3 BMD.9(HALL_SENSOR3)
MB_MW1: BMD.1(MOTOR_WINDING1) BMW.C1
MB_MW2: BMD.2(MOTOR_WINDING2) BMW.C2
MB_MW3: BMD.3(MOTOR_WINDING3) BMW.C3
MB_OSPD: BMD.20(AN_OUT1) BOUT1.1(TP) MAIN_CONN_B.9
MB_PWM: BMD.17(DIG_IN1) MAIN_CONN_B.6
MC_CHA: CENC.A6 CMD.10(ENCODER_CHA)
MC_CHA\\: CENC.A5 CMD.11(ENCODER_CHA\\)
MC_CHB: CENC.A8 CMD.12(ENCODER_CHB)
MC_CHB\\: CENC.A7 CMD.13(ENCODER_CHB\\)
MC_DIR: CMD.14(DIG_IN/OUT4) MAIN_CONN_C.4
MC_HS1: CHAL.B1 CMD.7(HALL_SENSOR1)
MC_HS2: CHAL.B2 CMD.8(HALL_SENSOR2)
MC_HS3: CHAL.B3 CMD.9(HALL_SENSOR3)
MC_MW1: CMD.1(MOTOR_WINDING1) CMW.C1
MC_MW2: CMD.2(MOTOR_WINDING2) CMW.C2
MC_MW3: CMD.3(MOTOR_WINDING3) CMW.C3
MC_OSPD: CMD.20(AN_OUT1) COUT1.1(TP) MAIN_CONN_C.9
MC_PWM: CMD.17(DIG_IN1) MAIN_CONN_C.6
MD_CHA: DENC.A6 DMD.10(ENCODER_CHA)
MD_CHA\\: DENC.A5 DMD.11(ENCODER_CHA\\)
MD_CHB: DENC.A8 DMD.12(ENCODER_CHB)
MD_CHB\\: DENC.A7 DMD.13(ENCODER_CHB\\)
MD_DIR: DMD.14(DIG_IN/OUT4) MAIN_CONN_D.4
MD_HS1: DHAL.B1 DMD.7(HALL_SENSOR1)
MD_HS2: DHAL.B2 DMD.8(HALL_SENSOR2)
MD_HS3: DHAL.B3 DMD.9(HALL_SENSOR3)
MD_MW1: DMD.1(MOTOR_WINDING1) DMW.C1
MD_MW2: DMD.2(MOTOR_WINDING2) DMW.C2
MD_MW3: DMD.3(MOTOR_WINDING3) DMW.C3
MD_OSPD: DMD.20(AN_OUT1) DOUT1.1(TP) MAIN_CONN_D.9
MD_PWM: DMD.17(DIG_IN1) MAIN_CONN_D.6
N$1: LED8.3(DOUT) LED9.2(DIN)
N$2: LED10.3(DOUT) LED11.2(DIN)
N$3: LED11.3(DOUT) LED12.2(DIN)
N$4: LED9.3(DOUT) LED10.2(DIN)
N$5: LED12.3(DOUT) LED13.2(DIN)
N$6: LED13.3(DOUT) LED14.2(DIN)
N$7: LED14.3(DOUT) LED15.2(DIN)
N$8: LED15.3(DOUT) LED16.2(DIN)
N$9: LED16.3(DOUT) LED17.2(DIN)
N$10: LED17.3(DOUT) LED18.2(DIN)
N$11: LED18.3(DOUT) LED19.2(DIN)
N$12: LED19.3(DOUT) LED20.2(DIN)
N$13: LED20.3(DOUT) LED21.2(DIN)
N$14: LED21.3(DOUT) LED22.2(DIN)
N$15: LED22.3(DOUT) LED23.2(DIN)
N$16: LED23.3(DOUT) LED24.2(DIN)
N$17: LED24.3(DOUT) LED25.2(DIN)
N$18: LED25.3(DOUT) LED26.2(DIN)
N$19: LED26.3(DOUT) LED27.2(DIN)
N$20: LED27.3(DOUT) LED28.2(DIN)
N$21: LED28.3(DOUT) LED29.2(DIN)
N$22: LED29.3(DOUT) LED30.2(DIN)
N$23: LED30.3(DOUT) LED31.2(DIN)
N$24: LED0.3(DOUT) LED1.2(DIN)
N$25: LED1.3(DOUT) LED2.2(DIN)
N$26: LED2.3(DOUT) LED3.2(DIN)
N$27: LED3.3(DOUT) LED4.2(DIN)
N$28: LED4.3(DOUT) LED5.2(DIN)
N$29: LED5.3(DOUT) LED6.2(DIN)
N$30: LED6.3(DOUT) LED7.2(DIN)
N$31: LED7.3(DOUT) LED8.2(DIN)
N$32: D1.C KICKER_R_CONN.P QR.S
N$33: D2.C KICKER_F_CONN.P QF.S
N$34: QF.G R49.1
N$35: LED40.3(DOUT) LED41.2(DIN)
N$36: LED41.3(DOUT) LED42.2(DIN)
N$37: LED42.3(DOUT) LED43.2(DIN)
N$38: LED43.3(DOUT) LED44.2(DIN)
N$39: LED44.3(DOUT) LED45.2(DIN)
N$40: LED45.3(DOUT) LED46.2(DIN)
N$41: LED46.3(DOUT) LED47.2(DIN)
N$42: MOSDRIVER.7(OUT_1) R48.2
N$43: LED32.3(DOUT) LED33.2(DIN)
N$44: LED33.3(DOUT) LED34.2(DIN)
N$45: LED34.3(DOUT) LED35.2(DIN)
N$46: LED35.3(DOUT) LED36.2(DIN)
N$47: LED36.3(DOUT) LED37.2(DIN)
N$48: LED37.3(DOUT) LED38.2(DIN)
N$49: LED38.3(DOUT) LED39.2(DIN)
N$50: LED39.3(DOUT) LED40.2(DIN)
N$51: MOSDRIVER.5(OUT_2) R49.2
N$52: AMD.19(AN_OUT2) AOUT2.1(TP)
N$53: QR.G R48.1
N$54: BMD.19(AN_OUT2) BOUT2.1(TP)
N$56: CMD.19(AN_OUT2) COUT2.1(TP)
N$58: DMD.19(AN_OUT2) DOUT2.1(TP)
X_LINE0: PHOTO32.2 R32.1 XMUX.9(I0)
X_LINE1: PHOTO33.2 R33.1 XMUX.8(I1)
X_LINE2: PHOTO34.2 R34.1 XMUX.7(I2)
X_LINE3: PHOTO35.2 R35.1 XMUX.6(I3)
X_LINE4: PHOTO36.2 R36.1 XMUX.5(I4)
X_LINE5: PHOTO37.2 R37.1 XMUX.4(I5)
X_LINE6: PHOTO38.2 R38.1 XMUX.3(I6)
X_LINE7: PHOTO39.2 R39.1 XMUX.2(I7)
X_LINE8: PHOTO40.2 R40.1 XMUX.23(I8)
X_LINE9: PHOTO41.2 R41.1 XMUX.22(I9)
X_LINE10: PHOTO42.2 R42.1 XMUX.21(I10)
X_LINE11: PHOTO43.2 R43.1 XMUX.20(I11)
X_LINE12: PHOTO44.2 R44.1 XMUX.19(I12)
X_LINE13: PHOTO45.2 R45.1 XMUX.18(I13)
X_LINE14: PHOTO46.2 R46.1 XMUX.17(I14)
X_LINE15: PHOTO47.2 R47.1 XMUX.16(I15)
Unconnected: AENC.A1 AENC.A4 AENC.A9 AENC.A10 AHAL.B6 AMD.16(DIG_IN2) AMD.21(AN_IN2-) AMD.22(AN_IN2+) AMD.23(AN_IN1-) AMD.24(AN_IN1+) AMW.C4 BENC.A1 BENC.A4 BENC.A9 BENC.A10 BHAL.B6 BMD.16(DIG_IN2) BMD.21(AN_IN2-) BMD.22(AN_IN2+) BMD.23(AN_IN1-) BMD.24(AN_IN1+) BMW.C4 CENC.A1 CENC.A4 CENC.A9 CENC.A10 CHAL.B6 CMD.16(DIG_IN2) CMD.21(AN_IN2-) CMD.22(AN_IN2+) CMD.23(AN_IN1-) CMD.24(AN_IN1+) CMW.C4 DENC.A1 DENC.A4 DENC.A9 DENC.A10 DHAL.B6 DMD.16(DIG_IN2) DMD.21(AN_IN2-) DMD.22(AN_IN2+) DMD.23(AN_IN1-) DMD.24(AN_IN1+) DMW.C4 LED31.3(DOUT) LED47.3(DOUT)

## Library data of the parts
AENC BENC CENC DENC = PIN2.54-2X5:PIN2.54-2X5: Connector for EC-FLAT45(encoder): Can be bought at gme.sk: https://www.gme.sk/v/1498388/kls-mlw10g-konektor-vidlice-roztec-254mm-2x5pinov-priama-do-dps
AHAL BHAL CHAL DHAL = MX-44914-0601:MX-44914-0601: Connector for EC-FLAT45(hall sensor): Can be bought trough tme.eu: https://www.tme.eu/gb/details/mx-44914-0601/other-connectors-molex/molex/449140601/
AMD BMD CMD DMD = ESCON_24-2:ESCON24/2
AMUX BMUX XMUX = CD74HC4067SM96:CD74HC4067SM96
AMW BMW CMW DMW = MX5566:MX5566: Connector for EC-FLAT45(motor windings): Can be bought on gme.sk: https://www.gme.sk/v/1496575/molex-39-28-1043-mini-fit-vidlica-rozstup-42mm-2x2piny-priama-do-dps
AOUT1 AOUT2 BOUT1 BOUT2 COUT1 COUT2 DOUT1 DOUT2 = LinkedLibrary52101:TESTPOINT_TPS: TEST POINT PAD; BOM: EXCLUDE
BOOST_IN BOOST_OUT KICKER_F_CONN KICKER_R_CONN POWER_CONN = XT30UPB-M:XT30UPB-M: Check availability <https://pricing.snapeda.com/parts/XT30UPB-M/amass/view-part?ref=eda>; AVAILABILITY: In Stock; CHECK_PRICES: https://www.snapeda.com/parts/XT30UPB-M/AMASS/view-part/?ref=eda; DESCRIPTION: Socket; DC supply; XT30; male; PIN: 2; on PCBs; THT; yellow; 15A; 500V; MF: amass; MP: XT30UPB-M; PACKAGE: None; PRICE: None; SNAPEDA_LINK: https://www.snapeda.com/parts/XT30UPB-M/AMASS/view-part/?ref=snap
C1 C9 C17 C25 C101 C105 C109 C113 C201-C228 = Capacitor:C: Capacitor - Generic; CATEGORY: Capacitor
D1 D2 = Diodes-2:1N4740A-TR: DIODE ZENER 10V 1.3W DO41 Manufacturer's datasheet <https://www.vishay.com/docs/85816/1n4728a.pdf>; CREATED_BY: PCBLayout.com; DIGIKEY_PART_NUMBER: 1N4740AVSCT-ND; MANUFACTURER: Vishay General Semiconductor - Diodes Division; MPN: 1N4740A-TR; PACKAGE: DO-41
LED0 LED1-LED47 = 2025-12-23_15-34-03_Library:LTST-E563CEGBW; COPYRIGHT: Copyright (C) 2025 Ultra Librarian. All rights reserved.; MANUFACTURER_NAME: LITE-ON; MANUFACTURER_PART_NUMBER: LTST-E563CEGBW; TYPE: LED Addressable
MAIN_CONN_A MAIN_CONN_B MAIN_CONN_C MAIN_CONN_D = Connector:PINHD-2X5PIXY: PIN HEADER; CATEGORY: CONNECTOR; SUB-CATEGORY: PIN-HEADER
MOSDRIVER = 2025-12-28_13-06-10_Library:PM8834TR; COPYRIGHT: Copyright (C) 2025 Ultra Librarian. All rights reserved.; DATASHEET: https://www.st.com/resource/en/datasheet/pm8834.pdf; DESCRIPTION: 4 A dual low side MOSFET driver; MANUFACTURER_NAME: STMicroelectronics; MANUFACTURER_PART_NUMBER: PM8834TR
PHOTO0 PHOTO1-PHOTO47 = 2025-12-23_15-50-12_Library:RPM-075PTT86; COPYRIGHT: Copyright (C) 2025 Ultra Librarian. All rights reserved.; MANUFACTURER_NAME: ROHM Semiconductor; MANUFACTURER_PART_NUMBER: RPM-075PTT86
QF QR = Transistor:NMOSFET_: N-Channel MOSFET - Popular parts; CATEGORY: Transistor; DESCRIPTION: MOSFET N-CH 100V 9.7A TO-220AB; DRAIN_CURRENT: 9.7A; MANUFACTURER: Infineon Technologies; MPN: IRF520NPBF; OPERATING_TEMP: -55°C ~ 175°C; PART_STATUS: Active; ROHS_COMPLIANT: Yes; SUB-CATEGORY: MOSFET; THERMALLOSS: 48W; TYPE: N-Channel
R0 R1-R49 R97 R98 = Resistor:R: Resistor Fixed - Generic; CATEGORY: Resistor; SUB-CATEGORY: Fixed